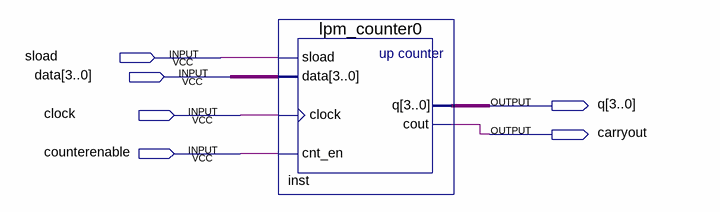
[diagram p0: schematic sheet]
// Quartus schematic final.bdf as structural Verilog: 1 symbols, 6 pins
module \final  (
  input  sload,
  input  [3:0] data,
  input  clock,
  input  counterenable,
  output [3:0] q,
  output carryout
);

  lpm_counter0 inst (.sload(sload), .data(data), .clock(clock), .cnt_en(counterenable), .cout(carryout), .q(q));
endmodule
